# Altium schematic sheet 03-power.SchDoc
size A3
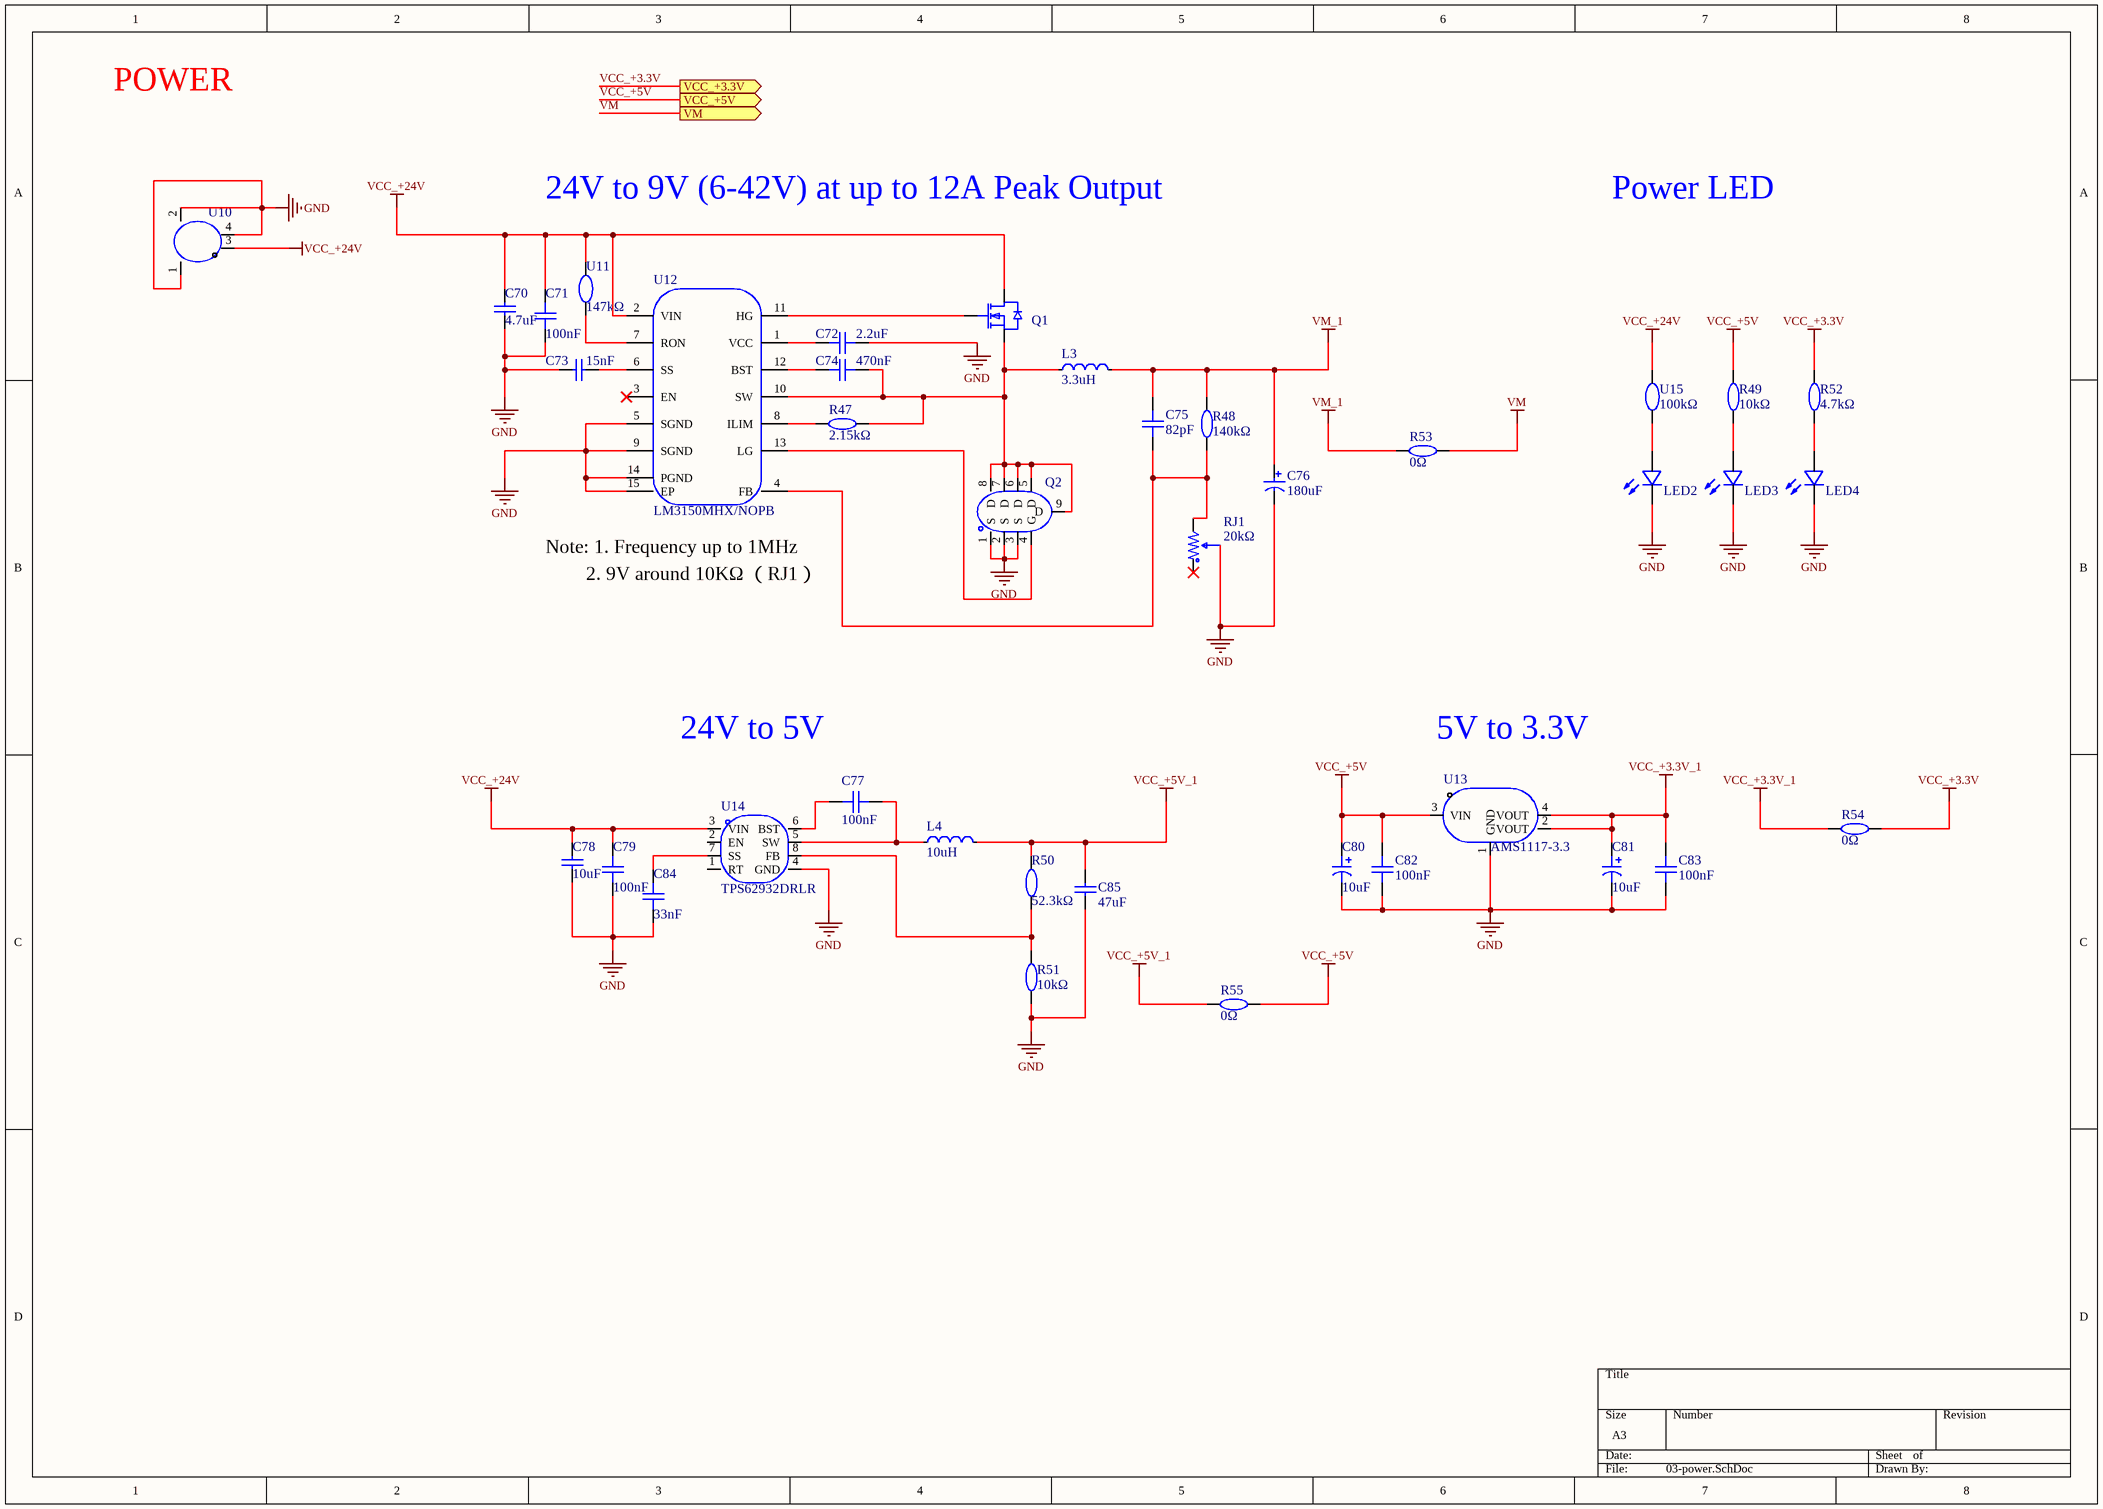
[diagram p0: 03-power.SchDoc]

## Parts
C70  4.7uF  [C1206]
C71  100nF  [C0603]
C72  2.2uF  [C0603]
C73  15nF  [C1206]
C74  470nF  [C0603]
C75  82pF  [C0805]
C76  180uF  [SMD6.3_10_180uF]
C77  100nF  [C0402_2.2uF]
C78  10uF  [C1206]
C79  100nF  [C0402_2.2uF]
C80  10uF  [SMD5_5.4_10uF]
C81  10uF  [SMD5_5.4_10uF]
C82  100nF  [C0603]
C83  100nF  [C0603]
C84  33nF  [C0402_2.2uF]
C85  47uF  [C1206]
L3  3.3uH  [L1360]
L4  10uH  [L1110_10uH]
LED2  MHT192UGCT  [LED]  (value not drawn)
LED3  MHT192UGCT  [LED]  (value not drawn)
LED4  MHT192UGCT  [LED]  (value not drawn)
Q1  IRLR8726TRPBF  [NMOS]  (value not drawn)
Q2  CSD18533Q5A  [CSD18533Q5A]  (value not drawn)
R47  2.15kΩ  [R0603]
R48  140kΩ  [R0805]
R49  10kΩ  [R0603_10KΩ]
R50  52.3kΩ  [R0603_10KΩ]
R51  10kΩ  [R0603_10KΩ]
R52  4.7kΩ  [R0603_10KΩ]
R53  0Ω  [R0603]
R54  0Ω  [R0603]
R55  0Ω  [R0603]
RJ1  20kΩ  [R20k_KT]
U10  XT60PW-F  [XT60PW-F]  (value not drawn)
U11  147kΩ  [R0603]
U12  LM3150MHX/NOPB  [LM3150MHX/NOPB]
U13  AMS1117-3.3  [AMS1117-3.3]
U14  TPS62932DRLR  [TPS62932DRLR]
U15  100kΩ  [R0603]

## Ports
VCC_+3.3V (out), VCC_+5V (out), VM (out)

## Nets
GND: C70.1 C71.1 C72.2 C73.1 C76.2 C78.1 C79.1 C80.2 C81.2 C82.2 C83.2 C84.1 C85.1 LED2.1(-) LED3.1(-) LED4.1(-) Q2.1(S) Q2.2(S) Q2.3(S) R51.1 RJ1.2 U10.1 U10.2 U10.4 U12.5(SGND) U12.9(SGND) U12.14(PGND) U12.15(EP) U13.1(GND) U14.4(GND)
VCC_+3.3V: R52.2 R54.2 ; port VCC_+3.3V
VCC_+3.3V_1: C81.1 C83.1 R54.1 U13.2(VOUT) U13.4(VOUT)
VCC_+5V: C80.1 C82.1 R49.2 R55.2 U13.3(VIN) ; port VCC_+5V
VCC_+5V_1: C85.2 L4.2 R50.2 R55.1
VCC_+24V: C70.2 C71.2 C78.2 C79.2 Q1.2(D) U10.3 U11.2 U12.2(VIN) U14.3(VIN) U15.2
VM: R53.2 ; port VM
VM_1: C75.2 C76.1 L3.2 R48.2 R53.1
NetC72_1: C72.1 U12.1(VCC)
NetC73_2: C73.2 U12.6(SS)
NetC74_1: C74.1 U12.12(BST)
NetC74_2: C74.2 L3.1 Q1.3(S) Q2.5(D) Q2.6(D) Q2.7(D) Q2.8(D) Q2.9(D) R47.2 U12.10(SW)
NetC75_1: C75.1 R48.1 RJ1.3 U12.4(FB)
NetC77_1: C77.1 U14.6(BST)
NetC77_2: C77.2 L4.1 U14.5(SW)
NetC84_2: C84.2 U14.7(SS)
NetLED2_2: LED2.2(+) U15.1
NetLED3_2: LED3.2(+) R49.1
NetLED4_2: LED4.2(+) R52.1
NetQ1_1: Q1.1(G) U12.11(HG)
NetQ2_4: Q2.4(G) U12.13(LG)
NetR47_1: R47.1 U12.8(ILIM)
NetR50_1: R50.1 R51.2 U14.8(FB)
NetU11_1: U11.1 U12.7(RON)

Not connected (* = marked no-connect by the designer): RJ1 1*; U12 3(EN)*; U14 1(RT) 2(EN)

## Notes on the sheet
- POWER
- 24V to 9V (6-42V) at up to 12A Peak Output
- Power LED
- (near U12) Note: 1. Frequency up to 1MHz
- 2. 9V around 10KΩ （RJ1）
- 24V to 5V
- 5V to 3.3V

## Library data of the parts
C70 = C1206_4.7uF: 1206电容; Manufacturer: SAMSUNG(三星); Symbol: CL31B475KBHNNNE; Add into BOM: yes; Tolerance: ±10%; Voltage Rated: 50V; Temperature Coefficient: X7R; Device: CL31B475KBHNNNE; LCSC Part Name: 4.7uF ±10% 50V; Supplier Part: C51205; Manufacturer Part: CL31B475KBHNNNE; Supplier Footprint: 1206; JLCPCB Part Class: Extended Part; Datasheet: https://atta.szlcsc.com/upload/public/pdf/source/20160218/1457707763339.pdf; Supplier: LCSC; Convert to PCB: yes; Value: 4.7uF; Comment_1: 4.7uF
C71 C82 C83 = C0603_100nF: 0603电容; Manufacturer: SAMSUNG(三星); Symbol: CC0603KRX7R9BB104; Add into BOM: yes; Tolerance: ±10%; Voltage Rated: 50V; Temperature Coefficient: X7R; Name: 100nF; Device: CC0603KRX7R9BB104; LCSC Part Name: 100nF ±10% 50V; Supplier Part: C6119867; Manufacturer Part: CC0603KRX7R9BB104; Supplier Footprint: 0603; JLCPCB Part Class: Basic Part; Datasheet: https://atta.szlcsc.com/upload/public/pdf/source/20180910/C282072_33301C7F631E79921B82A8DAC6BCC5B3.pdf; Supplier: LCSC; Convert to PCB: yes; Value: 100nF
C72 = C0603_2.2uF: 0603电容; Manufacturer: SAMSUNG(三星); Symbol: CC0603KRX7R9BB104; Add into BOM: yes; Tolerance: ±10%; Voltage Rated: 16V; Temperature Coefficient: X5R; Name: 2.2uF; Device: CC0603KRX7R9BB104; LCSC Part Name: 2.2uF ±10% 16V; Supplier Part: C23630; Manufacturer Part: CC0603KRX7R9BB104; Supplier Footprint: 0603; JLCPCB Part Class: Basic Part; Datasheet: https://atta.szlcsc.com/upload/public/pdf/source/20180910/C282072_33301C7F631E79921B82A8DAC6BCC5B3.pdf; Supplier: LCSC; Convert to PCB: yes; Value: 2.2uF
C73 = C1206_15nF: 1206电容; Manufacturer: Chinocera(华瓷); Symbol: CL31B475KBHNNNE; Add into BOM: yes; Tolerance: ±10%; Voltage Rated: 50V; Temperature Coefficient: X7R; Device: CL31B475KBHNNNE; LCSC Part Name: 15nF ±10% 50V; Supplier Part: C5186924; Manufacturer Part: CL31B475KBHNNNE; Supplier Footprint: 1206; JLCPCB Part Class: Extended Part; Datasheet: https://atta.szlcsc.com/upload/public/pdf/source/20160218/1457707763339.pdf; Supplier: LCSC; Convert to PCB: yes; Value: 15nF; Comment_1: 15nF
C74 = C0603_470nF: 0603电容; Manufacturer: SAMSUNG(三星); Symbol: CC0603KRX7R9BB104; Add into BOM: yes; Tolerance: ±10%; Voltage Rated: 25V; Temperature Coefficient: X7R; Name: 470nF; Device: CC0603KRX7R9BB104; LCSC Part Name: 470nF ±10% 25V; Supplier Part: C1623; Manufacturer Part: CC0603KRX7R9BB104; Supplier Footprint: 0603; JLCPCB Part Class: Basic Part; Datasheet: https://atta.szlcsc.com/upload/public/pdf/source/20180910/C282072_33301C7F631E79921B82A8DAC6BCC5B3.pdf; Supplier: LCSC; Convert to PCB: yes; Value: 470nF
C75 = C0805_82pF: 0805电容; Manufacturer: YAGEO(国巨); Symbol: CC0805FRNPO9BN820; Add into BOM: yes; Tolerance: ±1%; Voltage Rated: 50V; Temperature Coefficient: NP0; Device: CC0805FRNPO9BN820; LCSC Part Name: 82pF ±1% 50V; Supplier Part: C527189; Manufacturer Part: CC0805FRNPO9BN820; Supplier Footprint: 0805; JLCPCB Part Class: Extended Part; Datasheet: https://atta.szlcsc.com/upload/public/pdf/source/20200508/C527189_AF3BD45761C292EB11165A31B5122D16.pdf; Supplier: LCSC; Convert to PCB: yes; Value: 82pF; Comment_1: 82pF
C76 = SMD6.3_10_180uF: 贴片型铝电解电容; Manufacturer: PANASONIC(松下); Symbol: 16SVPE180M; Add into BOM: yes; Tolerance: ±20%; Rated Voltage: 16V; Ripple Current: 4.46A@100kHz; Equivalent Series Resistance(ESR): 11mΩ@100kHz; Type: 聚合物; φD: 6.3mm; L: 10mm; Lifetime @ Temp: 2000hrs@105℃; Device: 16SVPE180M; LCSC Part Name: 180uF ±20% 16V; Supplier Part: C88141; Manufacturer Part: 16SVPE180M; Supplier Footprint: SMD,D6.3xL10mm; JLCPCB Part Class: Extended Part; Datasheet: https://atta.szlcsc.com/upload/public/pdf/source/20171113/C88141_15105616557631116145.pdf; Supplier: LCSC; Convert to PCB: yes; Value: 180uF; Lead Spacing: -; Operating Temperature: -55℃~+105℃; Comment_1: 180uF
C77 C79 = C0402_100nF: 0402电容; Manufacturer: muRata(村田); Symbol: GRM155R71H104KE14D; Add into BOM: yes; Tolerance: ±10%; Voltage Rated: 50V; Temperature Coefficient: X7R; Device: GRM155R71H104KE14D; LCSC Part Name: 100nF ±10% 50V; Supplier Part: C77020; Manufacturer Part: GRM155R71H104KE14D; Supplier Footprint: 0402; JLCPCB Part Class: Extended Part; Datasheet: https://atta.szlcsc.com/upload/public/pdf/source/20180326/C77020_39BD49C951FF1AF0DB1F1FAC5AC1E401.pdf; Supplier: LCSC; Convert to PCB: yes; Value: 100nF; Comment_1: 100nF
C78 = C1206_10uF: 1206电容; Manufacturer: SAMSUNG(三星); Symbol: CL31B475KBHNNNE; Add into BOM: yes; Tolerance: ±10%; Voltage Rated: 50V; Temperature Coefficient: X7R; Device: CL31B475KBHNNNE; LCSC Part Name: 10uF ±10% 50V; Supplier Part: C89632; Manufacturer Part: CL31B475KBHNNNE; Supplier Footprint: 1206; JLCPCB Part Class: Extended Part; Datasheet: https://atta.szlcsc.com/upload/public/pdf/source/20160218/1457707763339.pdf; Supplier: LCSC; Convert to PCB: yes; Value: 10uF; Comment_1: 10uF
C80 C81 = SMD5_5.4_10uF: 贴片型铝电解电容; Manufacturer: KNSCHA(科尼盛); Symbol: RST10UF50V016; Add into BOM: yes; Tolerance: ±20%; Rated Voltage: 50V; Ripple Current: 24mA@120Hz; φD: 5mm; L: 5.4mm; Lifetime @ Temp: 2000hrs@105℃; Device: RST10UF50V016; LCSC Part Name: 10uF ±20% 50V; Supplier Part: C4747971; Manufacturer Part: RST10UF50V016; Supplier Footprint: SMD,D5xL5.4mm; JLCPCB Part Class: Extended Part; Datasheet: https://atta.szlcsc.com/upload/public/pdf/source/20220722/47144637C831FC4476CE4962252D8002.pdf; Supplier: LCSC; Convert to PCB: yes; Value: 10uF; Equivalent Series Resistance(ESR): -; Operating Temperature: -40℃~+105℃; Comment_1: 10uF
C84 = C0402_33nF: 0402电容; Manufacturer: FOJAN(富捷); Symbol: GRM155R71H104KE14D; Add into BOM: yes; Tolerance: ±10%; Voltage Rated: 50V; Temperature Coefficient: X7R; Device: GRM155R71H104KE14D; LCSC Part Name: 33nF ±10% 50V; Supplier Part: C7419416; Manufacturer Part: GRM155R71H104KE14D; Supplier Footprint: 0402; JLCPCB Part Class: Extended Part; Datasheet: https://atta.szlcsc.com/upload/public/pdf/source/20180326/C77020_39BD49C951FF1AF0DB1F1FAC5AC1E401.pdf; Supplier: LCSC; Convert to PCB: yes; Value: 33nF; Comment_1: 33nF
C85 = C1206_47uF: 1206电容; Manufacturer: HRE(芯声); Symbol: CL31B475KBHNNNE; Add into BOM: yes; Tolerance: ±20%; Voltage Rated: 25V; Temperature Coefficient: X5R; Device: CL31B475KBHNNNE; LCSC Part Name: 47uF ±20% 25V; Supplier Part: C6119973; Manufacturer Part: CL31B475KBHNNNE; Supplier Footprint: 1206; JLCPCB Part Class: Extended Part; Datasheet: https://atta.szlcsc.com/upload/public/pdf/source/20160218/1457707763339.pdf; Supplier: LCSC; Convert to PCB: yes; Value: 47uF; Comment_1: 47uF
L3 = L1360_3.3uH: 电感值 3.3uH   精度 ±20%   额定电流 16A   饱和电流(Isat) 22A   直流电阻(DCR) 6mΩ   类型 一体成型电感; Manufacturer: SXN(顺翔诺); Symbol: SMMS1360-3R3M; Add into BOM: yes; Device: SMMS1360-3R3M; LCSC Part Name: 3.3uH ±20% 22A; Supplier Part: C149526; Manufacturer Part: SMMS1360-3R3M; Supplier Footprint: SMD; JLCPCB Part Class: Extended Part; Datasheet: https://atta.szlcsc.com/upload/public/pdf/source/20210810/BBF24330FB2F5029F637830BA9C42C0D.pdf; Supplier: LCSC; Convert to PCB: yes; Value: 3.3uH; Tolerance: ±20%; Rated Current: 16A; Saturation Current (Isat): 22A; DC Resistance (DCR): 6mΩ; Type: 一体成型电感; Comment_1: 3.3uH
L4 = L1110_10uH: 功率电感; Manufacturer: YJYCOIN(益嘉源); Symbol: YSPI1050-100M; Add into BOM: yes; Tolerance: ±20%; Rated Current: 6A; DC Resistance (DCR): 19.3mΩ; Device: YSPI1050-100M; LCSC Part Name: 10uH ±20%; Supplier Part: C497897; Manufacturer Part: YSPI1050-100M; Supplier Footprint: SMD,11x10mm; JLCPCB Part Class: Extended Part; Datasheet: https://atta.szlcsc.com/upload/public/pdf/source/20240507/CDF618C6C30EFC34B42EA1108EE1A6A7.pdf; Supplier: LCSC; Convert to PCB: yes; Value: 10uH; Comment_1: 10uH
LED2-LED4 = LED: 发光二极管 绿色; Manufacturer: MEIHUA(美华); Add into BOM: yes; Emitted Color: 翠绿色; Power Dissipation: 60mW; Forward Current: 20mA; Dominant Wavelength: 515nm~530nm; Peak Wavelength: 518nm; Lens Color: 无色透明透镜; Viewing Angle: 120°; Symbol: MHT192UGCT; Device: MHT192UGCT; LCSC Part Name: 翠绿; Supplier Part: C389519; Manufacturer Part: MHT192UGCT; Supplier Footprint: 0603; JLCPCB Part Class: Extended Part; Datasheet: https://atta.szlcsc.com/upload/public/pdf/source/20190515/C389519_7BC27E831414348C8AF19AF18EE4BF58.pdf; Supplier: LCSC; Convert to PCB: yes; Diode Configuration: -; Color Temperature: -; Mounting Sytle: -; Operating Temperature: -40℃~+85℃; Comment_1: MHT192UGCT
Q1 = NMOS: 1个N沟道 耐压:30V 电流:86A; Manufacturer: Infineon(英飞凌); Add into BOM: yes; Drain Source Voltage (Vdss): 30V; Continuous Drain Current (Id): 86A; Power Dissipation (Pd): 75W; Drain Source On Resistance (RDS(on)@Vgs,Id): 5.8mΩ@10V,25A; Gate Threshold Voltage (Vgs(th)@Id): 2.35V@50uA; Total Gate Charge (Qg@Vgs): 23nC@4.5V; Input Capacitance (Ciss@Vds): 2.15nF@15V; Symbol: IRLR8726TRPBF; Device: IRLR8726TRPBF; LCSC Part Name: 1个N沟道 耐压:30V 电流:86A; Supplier Part: C81137; Manufacturer Part: IRLR8726TRPBF; Supplier Footprint: TO-252-2(DPAK); JLCPCB Part Class: Extended Part; Datasheet: https://atta.szlcsc.com/upload/public/pdf/source/20170518/1495085732211.pdf; Supplier: LCSC; Convert to PCB: yes; Type: 1个N沟道; Operating Temperature: -55℃~+175℃@(Tj); Comment_1: IRLR8726TRPBF
Q2 = CSD18533Q5A: NMOS 漏源电压(Vdss) 60V   连续漏极电流(Id) 17A；100A   功率(Pd) 3.2W；116W   导通电阻(RDS(on)@Vgs,Id) 5.9mΩ@10V,18A; Manufacturer: TI(德州仪器); Add into BOM: yes; Type: 1个N沟道; Gate Threshold Voltage (Vgs(th)@Id): 2.3V@250uA; Total Gate Charge (Qg@Vgs): 36nC@10V; Input Capacitance (Ciss@Vds): 2.75nF@30V; Symbol: CSD18533Q5A; Device: CSD18533Q5A; LCSC Part Name: 1个N沟道 耐压:60V 电流:17A 电流:100A; Supplier Part: C130170; Manufacturer Part: CSD18533Q5A; Supplier Footprint: VSONP-8(5x6); JLCPCB Part Class: Extended Part; Datasheet: https://www.ti.com/cn/lit/gpn/csd18533q5a; Supplier: LCSC; Convert to PCB: yes; Drain Source Voltage (Vdss): 60V; Continuous Drain Current (Id): 17A；100A; Power Dissipation (Pd): 3.2W；116W; Drain Source On Resistance (RDS(on)@Vgs,Id): 5.9mΩ@10V,18A; Operating Temperature: -55℃~+150℃@(Tj); Comment_1: CSD18533Q5A
R47 = R0603_2.15KΩ: 0603电阻; Manufacturer: YAGEO(国巨); Symbol: 0603WAF2001T5E; Add into BOM: yes; Tolerance: ±1%; Power(Watts): 100mW; Overload Voltage (Max): 75V; Temperature Coefficient: ±100ppm/℃; Device: 0603WAF2001T5E; LCSC Part Name: 2.15kΩ ±1% 100mW 厚膜电阻; Supplier Part: C273772; Manufacturer Part: 0603WAF2001T5E; Supplier Footprint: 0603; JLCPCB Part Class: Basic Part; Datasheet: https://atta.szlcsc.com/upload/public/pdf/source/20200306/C422600_1E6D84923E4A46A82E41ADD87F860B5C.pdf; Supplier: LCSC; Convert to PCB: yes; Type: 厚膜电阻; Value: 2.15kΩ; Operating Temperature Range: -55℃~+155℃; Comment_1: 2.15kΩ
R48 = R0805_140KΩ: 0805电阻; Manufacturer: UNI-ROYAL(厚声); Symbol: 0805W8F1403T5E; Add into BOM: yes; Tolerance: ±1%; Power(Watts): 125mW; Overload Voltage (Max): 150V; Temperature Coefficient: ±100ppm/℃; Device: 0805W8F1403T5E; LCSC Part Name: 140kΩ ±1% 125mW 厚膜电阻; Supplier Part: C17460; Manufacturer Part: 0805W8F1403T5E; Supplier Footprint: 0805; JLCPCB Part Class: Extended Part; Datasheet: https://atta.szlcsc.com/upload/public/pdf/source/20200306/C422600_1E6D84923E4A46A82E41ADD87F860B5C.pdf; Supplier: LCSC; Convert to PCB: yes; Type: 厚膜电阻; Value: 140kΩ; Operating Temperature Range: -55℃~+155℃; Comment_1: 140kΩ
R49 R51 = R0603_10KΩ: 0603电阻; Manufacturer: UNI-ROYAL(厚声); Symbol: 0603WAF1002T5E; Add into BOM: yes; Tolerance: ±1%; Power(Watts): 100mW; Overload Voltage (Max): 75V; Temperature Coefficient: ±100ppm/℃; Device: 0603WAF1002T5E; LCSC Part Name: 厚膜电阻 10kΩ ±1% 100mW; Supplier Part: C25804; Manufacturer Part: 0603WAF1002T5E; Supplier Footprint: 0603; JLCPCB Part Class: Basic Part; Datasheet: https://atta.szlcsc.com/upload/public/pdf/source/20200306/C422600_1E6D84923E4A46A82E41ADD87F860B5C.pdf; Supplier: LCSC; Convert to PCB: yes; Type: 厚膜电阻; Value: 10kΩ; Operating Temperature Range: -55℃~+155℃; Comment_1: 10kΩ
R50 = R0603_52.3KΩ: 0603电阻; Manufacturer: FOJAN(富捷); Symbol: 0603WAF1002T5E; Add into BOM: yes; Tolerance: ±1%; Power(Watts): 100mW; Overload Voltage (Max): 75V; Temperature Coefficient: ±100ppm/℃; Device: 0603WAF1002T5E; LCSC Part Name: 厚膜电阻 52.3kΩ ±1% 100mW; Supplier Part: C2933235; Manufacturer Part: 0603WAF1002T5E; Supplier Footprint: 0603; JLCPCB Part Class: Basic Part; Datasheet: https://atta.szlcsc.com/upload/public/pdf/source/20200306/C422600_1E6D84923E4A46A82E41ADD87F860B5C.pdf; Supplier: LCSC; Convert to PCB: yes; Type: 厚膜电阻; Value: 52.3kΩ; Operating Temperature Range: -55℃~+155℃; Comment_1: 52.3kΩ
R52 = R0603_4.7KΩ: 0603电阻; Manufacturer: UNI-ROYAL(厚声); Symbol: 0603WAF1002T5E; Add into BOM: yes; Tolerance: ±1%; Power(Watts): 100mW; Overload Voltage (Max): 75V; Temperature Coefficient: ±100ppm/℃; Device: 0603WAF1002T5E; LCSC Part Name: 厚膜电阻 4.7kΩ ±1% 100mW; Supplier Part: C23162; Manufacturer Part: 0603WAF1002T5E; Supplier Footprint: 0603; JLCPCB Part Class: Basic Part; Datasheet: https://atta.szlcsc.com/upload/public/pdf/source/20200306/C422600_1E6D84923E4A46A82E41ADD87F860B5C.pdf; Supplier: LCSC; Convert to PCB: yes; Type: 厚膜电阻; Value: 4.7kΩ; Operating Temperature Range: -55℃~+155℃; Comment_1: 4.7kΩ
R53-R55 = R0603_0Ω: 阻值 0Ω   精度 ±1%   功率 100mW   最大工作电压 75V   工作温度范围 -55℃~+155℃; Manufacturer: UNI-ROYAL(厚声); Symbol: 0603WAF0000T5E; Add into BOM: yes; Device: 0603WAF0000T5E; LCSC Part Name: 0Ω ±1% 100mW 厚膜电阻; Supplier Part: C21189; Manufacturer Part: 0603WAF0000T5E; Supplier Footprint: 0603; JLCPCB Part Class: Basic Part; Datasheet: https://atta.szlcsc.com/upload/public/pdf/source/20200306/C422600_1E6D84923E4A46A82E41ADD87F860B5C.pdf; Supplier: LCSC; Convert to PCB: yes; Type: 厚膜电阻; Value: 0Ω; Tolerance: ±1%; Power(Watts): 100mW; Overload Voltage (Max): 75V; Operating Temperature Range: -55℃~+155℃; Comment_1: 0Ω
RJ1 = R20k_KT: 可调电阻，20K; Manufacturer: BOURNS; Symbol: TC33X-2-203E; Add into BOM: yes; Tolerance: ±25%; Power(Watts): 100mW; Temperature Coefficient: ±250ppm/℃; Turns: 1; Device: TC33X-2-203E; LCSC Part Name: 20kΩ ±25%; Supplier Part: C720648; Manufacturer Part: TC33X-2-203E; Supplier Footprint: SMD-3P,3.8x3.6mm; JLCPCB Part Class: Extended Part; Datasheet: https://atta.szlcsc.com/upload/public/pdf/source/20200810/C720646_BB66A75E654D5E1D30127FF45BCD3C26.pdf; Supplier: LCSC; Convert to PCB: yes; Value: 20kΩ; Rated Voltage: -; Comment_1: 20kΩ
U10 = XT60PW-F: 卧式插头; Manufacturer: AMASS(艾迈斯); Symbol: XT60PW-F_C428722; Add into BOM: yes; InterfaceType: 母头; Device: XT60PW-F; LCSC Part Name: AMASS(艾迈斯)插头连接器锂电池组充电接口 航模电调卧式焊板 母头 XT60PW-F; Supplier Part: C428722; Manufacturer Part: XT60PW-F; Supplier Footprint: -; JLCPCB Part Class: Extended Part; Datasheet: https://atta.szlcsc.com/upload/public/pdf/source/20190916/C428722_DFF78979486FCB0B58C1FC563067EC88.pdf; Supplier: LCSC; Convert to PCB: yes; Power: -; Output: -; Input: -; Size: -; Interface: -; Type: 卧式插头; Colour: 黄色; MaximumCurrent: -; RatedVoltage: -; Type1: -; NumberOfUSBHoles: -; MetalMaterial: -; InsulationMaterial: -; RatedCurrent: -; RecommendedWireGauge: -; FlameRetardantGrade: -; contact resistance: -; Belt length: -; specifications: -; Comment_1: XT60PW-F
U11 = R0603_147KΩ: 0603电阻; Manufacturer: FOJAN(富捷); Symbol: FRC0603F1473TS; Add into BOM: yes; Tolerance: ±1%; Power(Watts): 100mW; Overload Voltage (Max): 75V; Temperature Coefficient: ±100ppm/℃; Device: FRC0603F1473TS; LCSC Part Name: 147kΩ ±1% 100mW 厚膜电阻; Supplier Part: C2998060; Manufacturer Part: FRC0603F1473TS; Supplier Footprint: 0603; JLCPCB Part Class: Extended Part; Datasheet: https://atta.szlcsc.com/upload/public/pdf/source/20211221/925EC7D7225764EE0046F22065062C87.pdf; Supplier: LCSC; Convert to PCB: yes; Type: 厚膜电阻; Value: 147kΩ; Operating Temperature Range: -55℃~+155℃; Comment_1: 147kΩ
U12 = LM3150MHX/NOPB: DC-DC电源芯片   功能类型 降压型   输入电压 6V~42V   输出电流 12A   开关频率 1MHz; Manufacturer: TI(德州仪器); Add into BOM: yes; Synchronous Rectification: 是; Number of Outputs: 1; Topology: 降压式; Symbol: LM3150MHX; Device: LM3150MHX/NOPB; LCSC Part Name: LM3150MHX/NOPB; Supplier Part: C48112; Manufacturer Part: LM3150MHX/NOPB; Supplier Footprint: HTSSOP-14-EP; JLCPCB Part Class: Extended Part; Datasheet: https://www.ti.com/cn/lit/gpn/lm3150; Supplier: LCSC; Convert to PCB: yes; Function: 降压型; Input Voltage: 6V~42V; Output Current (Max): 12A; Switching Frequency: 1MHz; Operating Temperature: -40℃~+125℃@(TJ); Comment_1: LM3150MHX/NOPB
U13 = AMS1117-3.3: 5V-3.3V; Manufacturer: AMS; Device: AMS1117-3.3_C6186; Add into BOM: yes; Output Type: 固定; Output Voltage: 3.3V; MAX Output Current: 1A; Power Supply Rejection Ratio (PSRR): 72dB@(120Hz); Dropout Voltage: 1.3V@(800mA); Output Polarity: 正极; Number of Outputs: 1; Symbol: AMS1117-3.3; LCSC Part Name: 输出3.3V 1A; Supplier Part: C6186; Manufacturer Part: AMS1117-3.3; Supplier Footprint: SOT-223; JLCPCB Part Class: Basic Part; Datasheet: https://atta.szlcsc.com/upload/public/pdf/source/20180727/C6186_7A095716F0823C02F1997A905E26C086.pdf; Supplier: LCSC; Convert to PCB: yes; Maximum Input Voltage: -; standby current: -; Noise: -; Feature: -; Operating Temperature: -; Comment_1: AMS1117-3.3
U14 = TPS62932DRLR: DCDC BUCK; Manufacturer: TI(德州仪器); Add into BOM: yes; Function: 降压型; Output Type: 可调; Input Voltage: 3.8V~30V; Output Voltage: 800mV~22V; Output Current (Max): 2A; Switching Frequency: 2.2MHz; Synchronous Rectification: 是; Number of Outputs: 1; Topology: 降压式; Switch tube (built-in/external): 内置; Symbol: TPS62932DRLR; Device: TPS62932DRLR; LCSC Part Name: TPS62932DRLR; Supplier Part: C3032935; Manufacturer Part: TPS62932DRLR; Supplier Footprint: SOT-5x3-8; JLCPCB Part Class: Extended Part; Datasheet: https://www.ti.com/cn/lit/gpn/tps62933; Supplier: LCSC; Convert to PCB: yes; Operating Temperature: -40℃~+150℃@(TJ); Comment_1: TPS62932DRLR
U15 = R0603_100KΩ: 0603电阻; Manufacturer: FOJAN(富捷); Symbol: FRC0603F1473TS; Add into BOM: yes; Tolerance: ±1%; Power(Watts): 100mW; Overload Voltage (Max): 75V; Temperature Coefficient: ±100ppm/℃; Device: FRC0603F1473TS; LCSC Part Name: 100kΩ ±1% 100mW 厚膜电阻; Supplier Part: C25803; Manufacturer Part: FRC0603F1473TS; Supplier Footprint: 0603; JLCPCB Part Class: Extended Part; Datasheet: https://atta.szlcsc.com/upload/public/pdf/source/20211221/925EC7D7225764EE0046F22065062C87.pdf; Supplier: LCSC; Convert to PCB: yes; Type: 厚膜电阻; Value: 100kΩ; Operating Temperature Range: -55℃~+155℃; Comment_1: 100kΩ